# EAGLE design solenoid_mosfet (EAGLE 5.08)
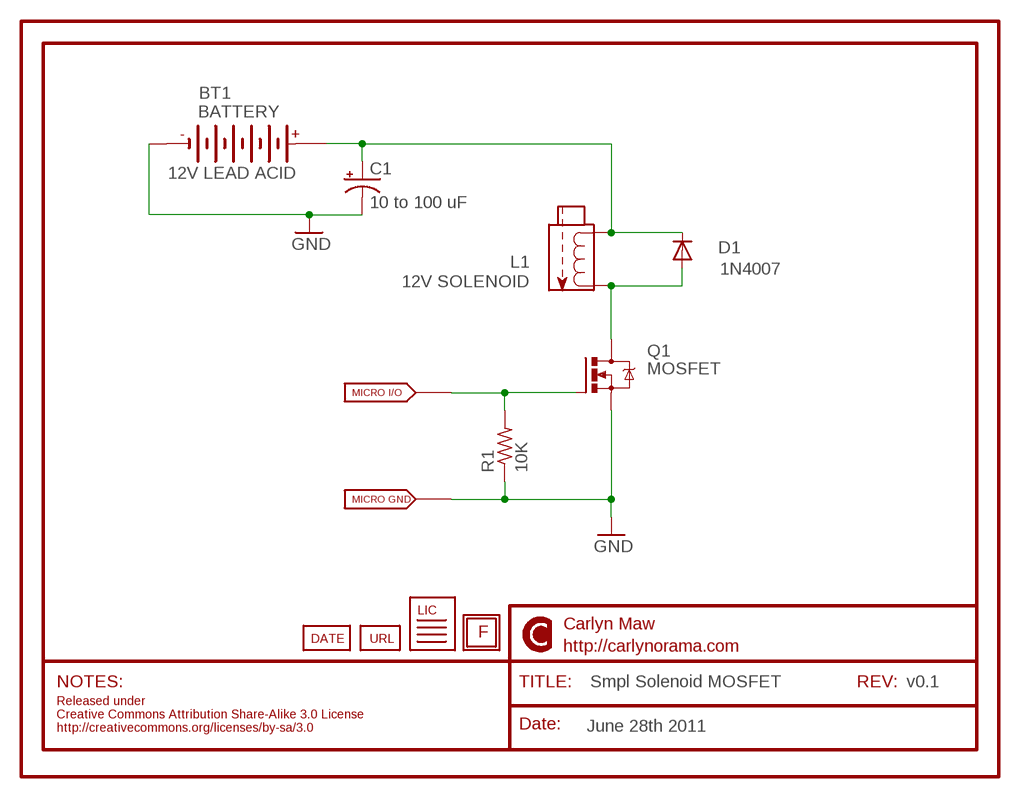
[diagram p0: schematic, sheet 1]

## Parts
ARDUINO  MICROPIN_IN_GND_WAGO508  [W237-132]
BATTERY  12V LEAD ACID  BAT_6CELL_WAGO508  [W237-132]
C1  10 to 100 uF  CAP_POLPTH2  [CPOL-RADIAL-10UF-25V]
D1  1N4007  1N4004  [DO41-10]
L1  12V SOLENOID  MOT_SOLENOID_PULL_INT_WAGO508  [W237-132]
Q1  MOSFET  TRANS_MOSFET_N_TO-220  [TO220_HORIZ]
R1  10K  R-US_0207/12  [0207/12]
U$6  DOC_BRD_REF_FRAME_2IN  [DOC_FRAME_S]
U$7  DOC_BRD_LIC_CC3_URL_1-27MM  [DOC_LIC_CC3_URL_1-27MM]
U$9  DOC_BRD_REF_URL_CRLYNORMA_0-056IN  [DOC_REF_URL_CRLYNORMA]
U$10  June 28, 2011  DOC_BRD_REF_DATE_MAN_0-05IN  [DOC_REF_DATE]

## Nets
GND: ARDUINO.2 BATTERY.2(-) C1.2(-) Q1.3(S) R1.1
N$1: ARDUINO.1 Q1.1(G) R1.2
N$3: D1.A L1.2 Q1.2(D)
N$4: BATTERY.1(+) C1.1(+) D1.C L1.1

## Notes on the sheet
- BT1
- Smpl Solenoid MOSFET | v0.1
- June 28th 2011

## Library data of the parts
ARDUINO = _carlynoramaCustom1:MICROPIN_IN_GND: Conection to Logic Circuit One logic I/O and GND
BATTERY = _carlynoramaCustom1:BAT_6CELL: 6 Cell Battery Typical of 12V Lead Acid (2.1 V/cell) and 9V Drycells (1.5 V/cell). Lithium batteries will differ depending on their chemistry.
C1 = SparkFun:CAP_POL: Capacitor Polarized These are standard SMD and PTH capacitors. Normally 10uF, 47uF, and 100uF in electrolytic and tantalum varieties. Always verify the external diameter of the through hole cap, it varies with capacity, voltage, and manufacturer. The EIA devices should be standard.
D1 = diode:1N4004: DIODE general purpose rectifier, 1 A
L1 = _carlynoramaCustom1:MOT_SOLENOID_PULL_INT
Q1 = _carlynoramaCustom1:TRANS_MOSFET_N
R1 = rcl:R-US_: RESISTOR, American symbol
U$6 = _carlynoramaCustom1:DOC_BRD_REF_FRAME: Device represetning a frame in the Document Layer (48) of the board file. In this case the S indicates a small one (2x2IN)
U$7 = _carlynoramaCustom1:DOC_BRD_LIC
U$9 = _carlynoramaCustom1:DOC_BRD_REF_URL
U$10 = _carlynoramaCustom1:DOC_BRD_REF_DATE

## Board
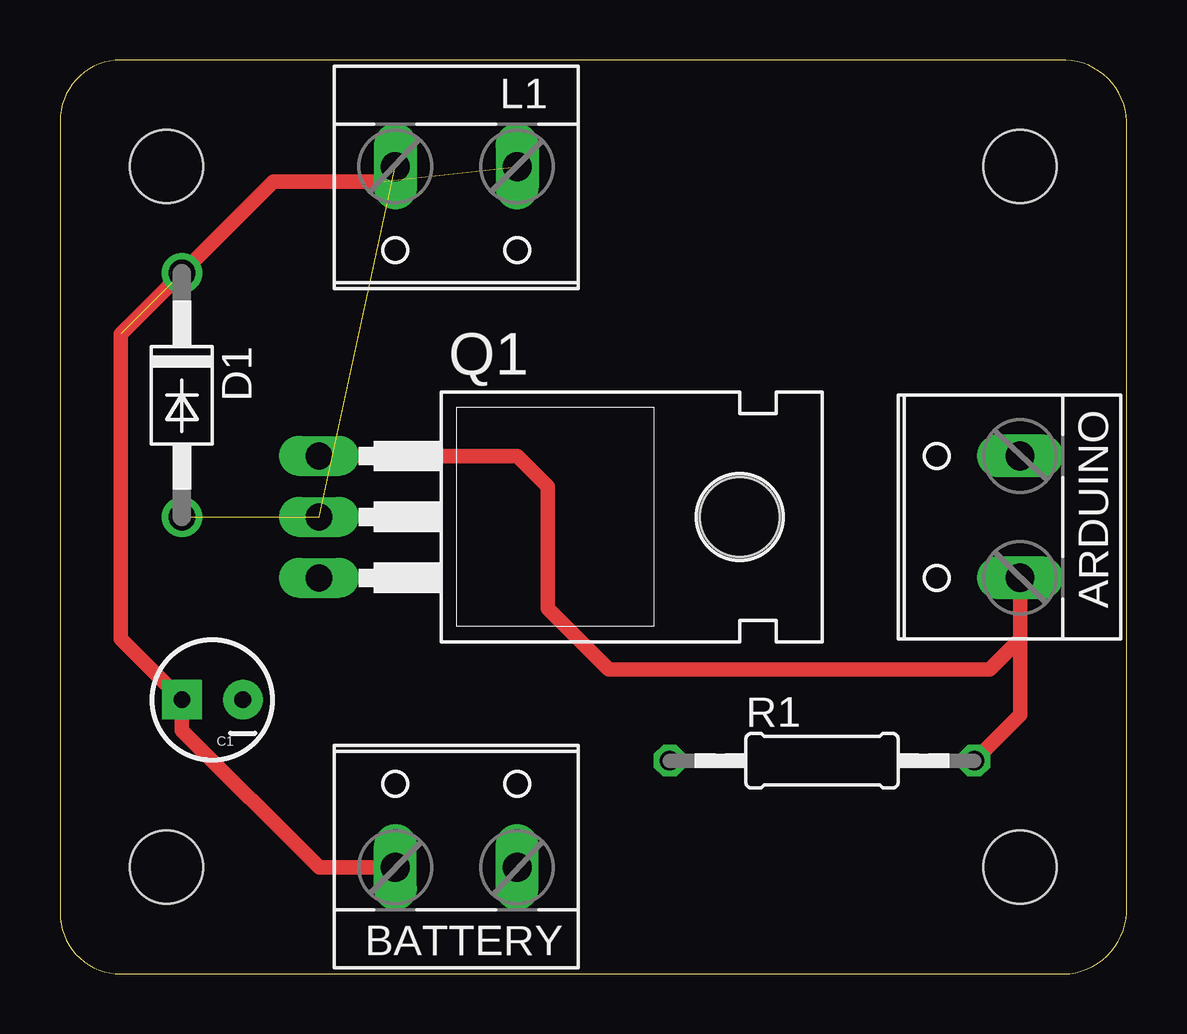
[diagram p1: board, top side]
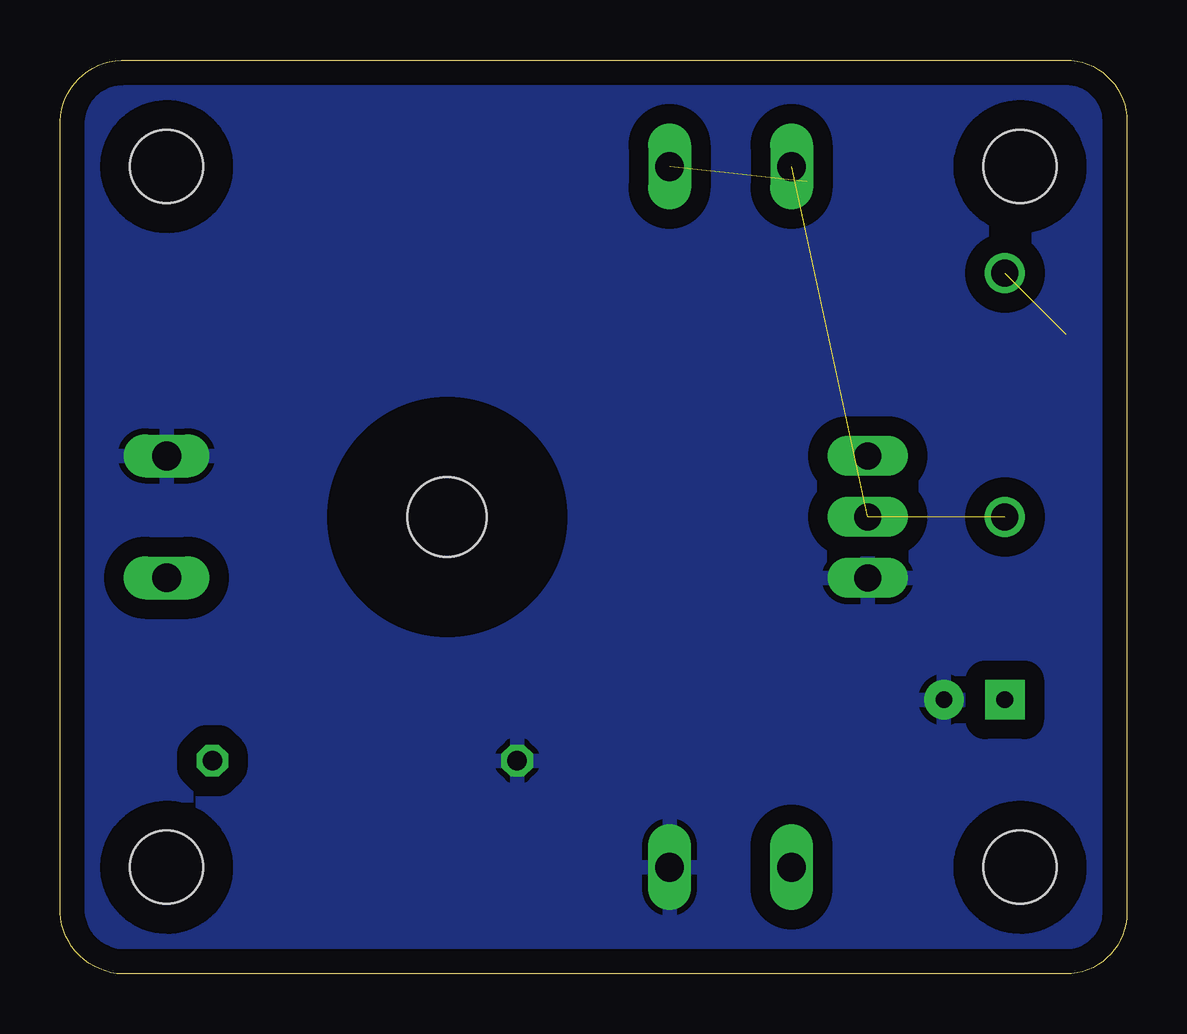
[diagram p2: board, bottom side, seen from below]

Size 44.45 x 38.1 mm. Coordinates in mm from the lower left corner, seen from the top.
Outline: 2.54,38.1 arc90 0,35.55 0,2.54 arc90 2.54,0 41.58,0 arc90 44.45,2.54 44.45,35.55 arc90 41.66,38.1 2.54,38.1
Copper layers (1*16): Top 0.035mm / dielectric 1.5mm / Bottom 0.035mm
Design rules "default": minimum track width 10mil, minimum drill 0.6mm, track to track 8mil, track to pad 8mil, pad to pad 8mil, via to via 8mil, smd to smd 8mil, copper to edge 40mil, drill to drill 8mil, minimum pad ring 10mil, minimum via ring 8mil, stop-mask expansion 4mil, vias tented up to drill 0mil, thermal gap 10mil

### Footprints (pad centres in the part's own frame; a part is rotated, then mirrored left to right if it is on the bottom)
W237-132 = drill 1.194 long: 1 -2.54,-0.635; 2 2.54,-0.635
CPOL-RADIAL-10UF-25V = drill 0.7 pad 1.651 square: 1 1.27,0 | drill 0.7 pad 1.651 round: 2 -1.27,0
DO41-10 = drill 1.118 round: A 5.08,0; C -5.08,0
TO220_HORIZ = drill 1.118 long: 1 -2.54,-6.35; 2 0,-6.35; 3 2.54,-6.35 | hole 3.302: 0,11.176
0207/12 = drill 0.813 octagon: 1 -6.35,0; 2 6.35,0
STAND-OFF-TIGHT = hole 3.048: 0,0

### Placement (x,y rotation side)
ARDUINO  39.37,19.05 90 top
BATTERY  16.51,5.08 0 top
C1  6.35,11.43 180 top
D1  5.08,24.13 270 top
L1  16.51,33.02 180 top
Q1  17.14,19.05 270 top
R1  31.75,8.89 0 top
U$1  [STAND-OFF-TIGHT]  40.01,33.66 0 top
U$2  [STAND-OFF-TIGHT]  40.01,4.45 0 top
U$3  [STAND-OFF-TIGHT]  4.45,33.66 0 top
U$4  [STAND-OFF-TIGHT]  4.45,4.45 0 top
U$6  -3.17,-10.16 0 top  (outside the outline)
U$7  -1.9,-7.62 0 top  (outside the outline)
U$9  -1.9,-5.08 0 top  (outside the outline)
U$10  31.75,-5.08 0 top  (outside the outline)

### Tracks (layer width: path | path; a pad name or v marks a point on that pad's centre or on a via)
GND
  pour Bottom (isolate 0.813): 1.27,36.83 43.18,36.83 43.18,1.27 1.27,1.27
N$1
  Top 0.61: R1.2 40.01,10.8 40.01,13.97 | 40.01,13.97 ARDUINO.1 | 40.01,13.97 38.73,12.7 22.86,12.7 20.32,15.24 20.32,20.32 19.05,21.59 Q1.1
N$3  (2 unrouted)
N$4  (2 unrouted)
  Top 0.61: 13.34,33.02 8.89,33.02 2.54,26.67 2.54,13.97 C1.1 5.08,10.16 10.8,4.45 BATTERY.1

### Text on the board
tValues: G | - | D | S | + | + | -